# Altium schematic sheet MS20_schematic.SchDoc
size A
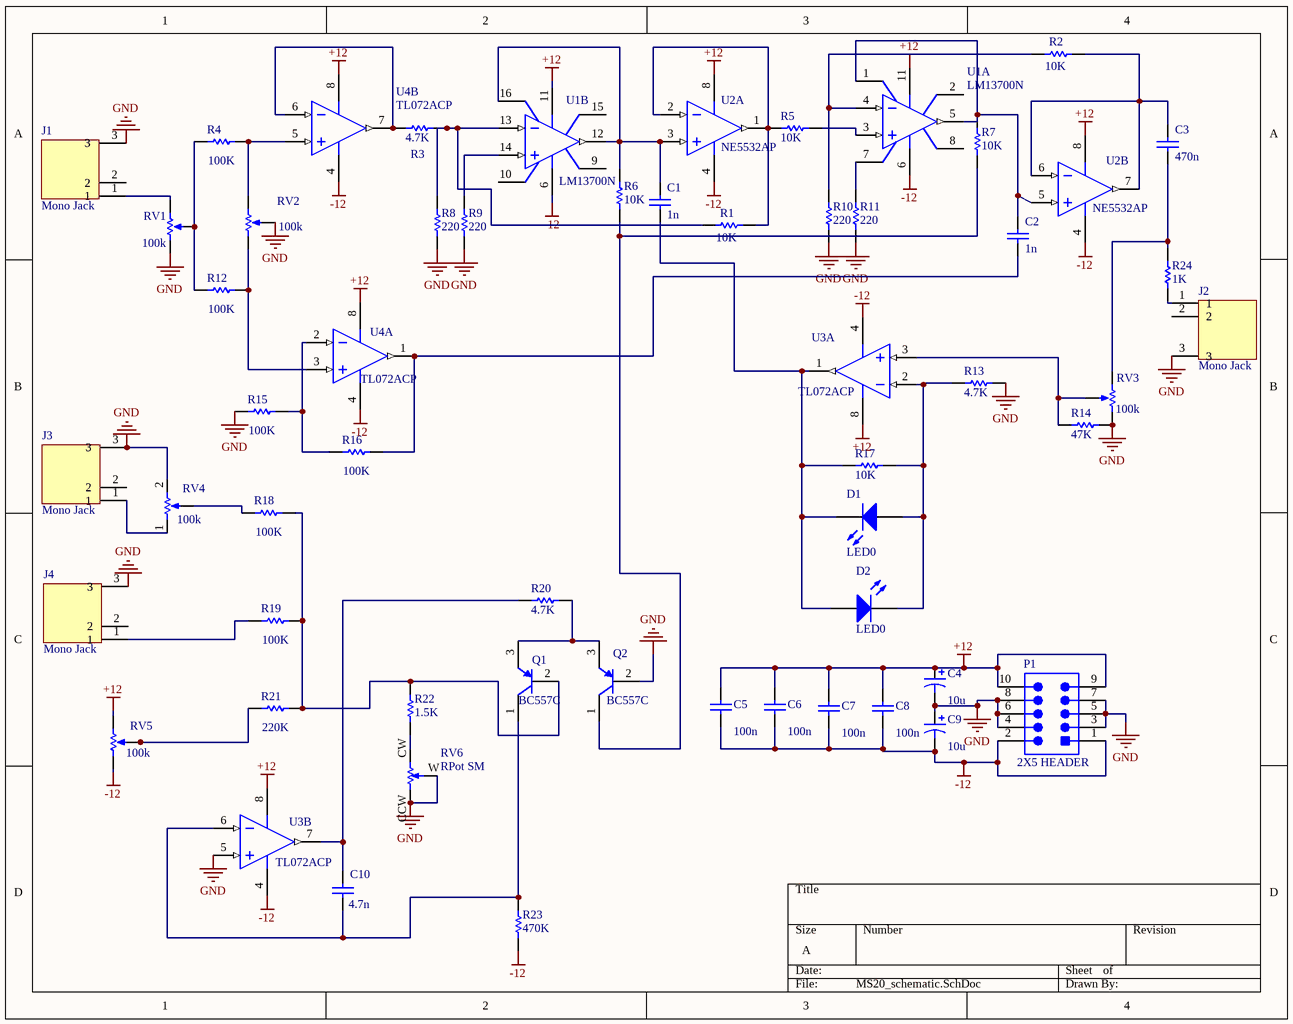
[diagram p0: MS20_schematic.SchDoc]

## Parts
C1  value 1n  [RAD-0.3]  (hidden comment: Cap)
C2  value 1n  [RAD-0.3]  (hidden comment: Cap)
C3  value 470n  [RAD-0.3]  (hidden comment: Cap)
C4  value 10u  [RB7.6-15]  (hidden comment: Cap Pol1)
C5  value 100n  [RAD-0.3]  (hidden comment: Cap)
C6  value 100n  [RAD-0.3]  (hidden comment: Cap)
C7  value 100n  [RAD-0.3]  (hidden comment: Cap)
C8  value 100n  [RAD-0.3]  (hidden comment: Cap)
C9  value 10u  [RB7.6-15]  (hidden comment: Cap Pol1)
C10  value 4.7n  [RAD-0.3]  (hidden comment: Cap)
D1  LED0  [LED-0]
D2  LED0  [LED-0]
J1  Mono Jack  [MONO_Jack]
J2  Mono Jack  [MONO_Jack]
J3  Mono Jack  [MONO_Jack]
J4  Mono Jack  [MONO_Jack]
P1  2X5 HEADER  [TECO-1-1634688-0-10_V]
Q1  BC557C  [ONSC-TO-92-3-29-11]
Q2  BC557C  [ONSC-TO-92-3-29-11]
R1  value 10K  [AXIAL-0.3]  (hidden comment: Res1)
R2  value 10K  [AXIAL-0.3]  (hidden comment: Res1)
R3  value 4.7K  [AXIAL-0.3]  (hidden comment: Res1)
R4  value 100K  [AXIAL-0.3]  (hidden comment: Res1)
R5  value 10K  [AXIAL-0.3]  (hidden comment: Res1)
R6  value 10K  [AXIAL-0.3]  (hidden comment: Res1)
R7  value 10K  [AXIAL-0.3]  (hidden comment: Res1)
R8  value 220  [AXIAL-0.3]  (hidden comment: Res1)
R9  value 220  [AXIAL-0.3]  (hidden comment: Res1)
R10  value 220  [AXIAL-0.3]  (hidden comment: Res1)
R11  value 220  [AXIAL-0.3]  (hidden comment: Res1)
R12  value 100K  [AXIAL-0.3]  (hidden comment: Res1)
R13  value 4.7K  [AXIAL-0.3]  (hidden comment: Res1)
R14  value 47K  [AXIAL-0.3]  (hidden comment: Res1)
R15  value 100K  [AXIAL-0.3]  (hidden comment: Res1)
R16  value 100K  [AXIAL-0.3]  (hidden comment: Res1)
R17  value 10K  [AXIAL-0.3]  (hidden comment: Res1)
R18  value 100K  [AXIAL-0.3]  (hidden comment: Res1)
R19  value 100K  [AXIAL-0.3]  (hidden comment: Res1)
R20  value 4.7K  [AXIAL-0.3]  (hidden comment: Res1)
R21  value 220K  [AXIAL-0.3]  (hidden comment: Res1)
R22  value 1.5K  [AXIAL-0.3]  (hidden comment: Res1)
R23  value 470K  [AXIAL-0.3]  (hidden comment: Res1)
R24  value 1K  [AXIAL-0.3]  (hidden comment: Res1)
RV1  value 100k  [VR5]  (hidden comment: RPot)
RV2  value 100k  [VR5]  (hidden comment: RPot)
RV3  value 100k  [VR5]  (hidden comment: RPot)
RV4  value 100k  [VR5]  (hidden comment: RPot)
RV5  value 100k  [VR5]  (hidden comment: RPot)
RV6  RPot SM  [POT4MM-2]
U1  LM13700N  [NFG0016A]  (parts A,B of 2)
U2  NE5532AP  [P0008A]  (parts A,B of 2)
U3  TL072ACP  [P0008A]  (parts A,B of 2)
U4  TL072ACP  [P0008A]  (parts A,B of 2)

## Nets
+12: C4.1 C5.1 C6.1 C7.1 C8.1 P1.9 P1.10 RV5.2(BOT) U1.11(V+) U2.8(VCC+) U3.8(VCC+) U4.8(VCC+)
-12: C5.2 C6.2 C7.2 C8.2 C9.2 P1.1 P1.2 R23.2 RV5.1(TOP) U1.6(V-) U2.4(VCC-) U3.4(VCC-) U4.4(VCC-)
GND: C4.2 C9.1 J1.3 J2.3 J3.3 J4.3 P1.3 P1.4 P1.5 P1.6 P1.7 P1.8 Q2.2(B) R8.1 R9.1 R10.1 R11.1 R13.1 R14.1 R15.1 RV1.1(TOP) RV2.3(TAP) RV3.2(BOT) RV4.2(BOT) RV6.CCW(-) RV6.W U3.5(IN2+)
NetC1_1: C1.1 R6.2 U1.12(OUT2) U1.16(AMP_BIAS_IN2) U2.3(IN1+)
NetC1_2: C1.2 D1.2(K) D2.1(A) R17.2 U3.1(OUT1)
NetC2_1: C2.1 R7.2 U1.1(AMP_BIAS_IN1) U1.5(OUT1) U2.5(IN2+)
NetC2_2: C2.2 R16.2 U4.1(OUT1)
NetC3_1: C3.1 R2.1 U2.6(IN2-) U2.7(OUT2)
NetC3_2: C3.2 R24.2 RV3.1(TOP)
NetC10_1: C10.1 R20.2 U3.7(OUT2)
NetC10_2: C10.2 Q1.1(C) R23.1 U3.6(IN2-)
NetD1_1: D1.1(A) D2.2(K) R13.2 R17.1 U3.2(IN1-)
NetJ1_1: J1.1 RV1.2(BOT)
NetJ2_1: J2.1 R24.1
NetJ3_1: J3.1 RV4.1(TOP)
NetJ4_1: J4.1 R19.1
NetQ1_2: Q1.2(B) R18.2 R19.2 R21.2 R22.2
NetQ1_3: Q1.3(E) Q2.3(E) R20.1
NetQ2_1: Q2.1(C) R6.1 R7.1
NetR1_1: R1.1 R5.2 U2.1(OUT1) U2.2(IN1-)
NetR1_2: R1.2 R3.1 R8.2 U1.13(IN2-)
NetR2_2: R2.2 R10.2 U1.4(IN1-)
NetR3_2: R3.2 U4.6(IN2-) U4.7(OUT2)
NetR4_1: R4.1 R12.1 RV1.3(TAP)
NetR4_2: R4.2 RV2.2(BOT) U4.5(IN2+)
NetR5_1: R5.1 U1.3(IN1+)
NetR9_2: R9.2 U1.14(IN2+)
NetR11_2: R11.2 U1.7(BUF_IN1)
NetR12_2: R12.2 RV2.1(TOP) U4.3(IN1+)
NetR14_2: R14.2 RV3.3(TAP) U3.3(IN1+)
NetR15_2: R15.2 R16.1 U4.2(IN1-)
NetR18_1: R18.1 RV4.3(TAP)
NetR21_1: R21.1 RV5.3(TAP)
NetR22_1: R22.1 RV6.CW(+)

Not connected (* = marked no-connect by the designer): J1 2; J2 2; J3 2; J4 2; U1 2(DIODE_BIAS1) 8(BUF_OUT1) 9(BUF_OUT2) 10(BUF_IN2) 15(DIODE_BIAS2)

## Library data of the parts
C1-C3 C5-C8 C10 = Cap: Capacitor; Published: 8-Jun-2000; LatestRevisionDate: 17-Jul-2002; LatestRevisionNote: Re-released for DXP Platform.; PackageReference: RAD-0.3; Publisher: Altium Limited; PackageDescription: Radial Cap, Thru-Hole; 2 Leads; 0.3 in Pin Spacing
C4 C9 = Cap Pol1: Polarized Capacitor (Radial); Published: 8-Jun-2000; LatestRevisionDate: 17-Jul-2002; LatestRevisionNote: Re-released for DXP Platform.; PackageReference: RB7.6-15; Publisher: Altium Limited; PackageDescription: Polarized Capacitor (Radial); 2 Leads
D1 D2 = LED0: Typical INFRARED GaAs LED; Published: 8-Jun-2000; LatestRevisionDate: 08-Jul-2005; LatestRevisionNote: Mech Layer 1 removed.; PackageReference: LED-0; Publisher: Altium Limited; PackageDescription: LED; 2 Leads
J1-J4 = 4832.2211: Phone Connectors Audio Socket 3.5MM 2P SCR; Manufacturer: Schurter; Body Material: Metal; Shielding: Shielded; Number of Ports: 1; Max Voltage Rating (AC): 30V; Number of Contacts: 2; Gender: Female; Current Rating: 500mA; Supplier 1: Digi-Key; Manufacturer Part Number: 4832.2211; RoHS: Yes; Category: Audio / Video Connectors; Stock 1: 363; Pricing 1: 1=1.50000, 50=1.38500, 100=1.13400, 500=0.94200, 1000=0.93840 (USD); Mount: Through Hole,Panel; Case/Package: Metal; Weight: 0.077603oz; Contact Plating: Silver; Number of Terminals: 3; Material: Plastic; Min Operating Temperature: -20°C; Max Operating Temperature: 70°C; Packaging: Bulk; Termination: Solder; Orientation: Straight; Package Quantity: 500; Max Current Rating: 500mA; Diameter: 3.5mm; Length: 10.5mm; Depth: 9mm; REACH SVHC: No SVHC; ComponentLink1URL: https://datasheet.ciiva.com/25289/1580985-25289573.pdf?src-supplier=Newark; ComponentLink1Description: https://datasheet.ciiva.com/25289/1580985-25289573.pdf?src-supplier=Newark; ComponentLink2URL: https://datasheet.ciiva.com/12540/typ-4832-2211-58787-12540719.pdf?src-supplier=Mouser; ComponentLink2Description: https://datasheet.ciiva.com/12540/typ-4832-2211-58787-12540719.pdf?src-supplier=Mouser; ComponentLink3URL: https://datasheet.ciiva.com/1086/1580985-1086284.pdf?src-supplier=Element14; ComponentLink3Description: https://datasheet.ciiva.com/1086/1580985-1086284.pdf?src-supplier=Element14; Supplier Part Number 1: 486-3418-ND
P1 = CMP-2000-05854-1: Male Header, Pitch 2.54 mm, 2 x 5 Postion, Height 9.15 mm, Tail Length 3.2 mm, -40 to 105 degC, RoHS, Bulk; Manufacturer: TE Connectivity; PartNumber: 1-1634688-0; No. of Rows: 2; SVHC: ToBeAdvised; Package Version: Rev. C2, 02/2011; No. of Contacts: 10Contacts; Pitch: 2.54mm; No. of Positions: 10; Contact Termination Type: ThroughHole; Package Description: 10-Pin Connector, Body 20.35 x 8.7 mm, Pitch 2.54 mm; Orientation: Straight; Gender: Header; Mounting Technology: ThroughHole; Product Range: -; Datasheet Version: Rev. C2, 02/2011; Contact Material: Brass; Package URL: https://datasheet.ciiva.com/6831/eng-cd-1634688-c2-6831201.pdf; Package Reference: 1-1634688-0; Pitch Spacing: 2.54mm; Contact Plating: GoldPlatedContacts; Manufacturer URL: http://www.te.com/; Datasheet URL: https://datasheet.ciiva.com/6831/eng-cd-1634688-c2-6831201.pdf
Q1 Q2 = CMP-1048-01449-1: Amplifier Transistor, PNP Silicon, 3-Pin TO-92, Bulk Box; Manufacturer: On Semiconductor; IC Continuous (A): -0.1; Polarity: PNP; PartNumber: BC557C; PackageVersion: Rev. AM; RoHS: FALSE; PackageDescription: 3-Pin Transistor Outline, Body 4.825 x 3.685 mm, Pitch 1.27 mm; Packing: Bulk Box; ComponentLink2Description: Datasheet; DatasheetVersion: Rev. 3; ComponentLink3Description: Package Specification; Mounting Technology: Through Hole; ComponentLink2URL: http://www.onsemi.com/pub_link/Collateral/BC556B-D.PDF; ComponentLink1URL: http://www.onsemi.com/; ComponentLink1Description: Manufacturer URL; ComponentLink3URL: http://www.onsemi.cn/pub_link/Collateral/2N6426-D.PDF; PackageReference: TO-92-3-29-11_AM_SL
R1-R24 = Res1: Resistor; Published: 8-Jun-2000; LatestRevisionDate: 17-Jul-2002; LatestRevisionNote: Re-released for DXP Platform.; PackageReference: AXIAL-0.3; Publisher: Altium Limited; PackageDescription: Axial Device, Thru-Hole; 2 Leads; 0.3 in Pin Spacing
RV1-RV5 = RPot: Potentiometer; Sim Note: Enter the Resistance value and the set point into parameter fields.; Set Position: 0.5; Published: 8-Jun-2000; LatestRevisionDate: 17-Jul-2002; LatestRevisionNote: Re-released for DXP Platform.; PackageReference: VR5; Publisher: Altium Limited; PackageDescription: Variable Resistor, Thru-Hole; 3 Leads
RV6 = RPot SM: Square Trimming Potentiometer; Published: 17-Dec-2003; DatasheetVersion: Oct-2003; PackageReference: POT4MM-2; Publisher: Altium Limited; PackageDescription: Square Trimming Potentiometer; ComponentLink1Description: Manufacturer Link; ComponentLink1URL: http://bourns.com/2/search.html
U1 = CMP-0055-00179-3: Dual Operational Transconductance Amplifier with Linearizing Diodes and Buffers, 16-pin MDIP; Manufacturer: Texas Instruments; CompType: Amplifiers; PackageTopMarking: NSUZXYYTTE#*LM13700N; PowerWise: N; PinCount: 16; ComponentLink1URL: http://www.ti.com/general/docs/lit/getliterature.tsp?genericPartNumber=LM13700&fileType=pdf; PackageDescription: MDIP, .750 x .250 x .130in, 16 Lead, .100in Pitch; Package Reference: NFG0016A; Code_JEDEC: MS-001-BB; ComponentLink1Description: Datasheet URL; RoHS: N
U2 = CMP-0017-00921-2: Dual Low-Noise Operational Amplifier, 10 to 30 V, 0 to 70 degC, 8-pin DIP (P8), Pb-Free (RoHS); Manufacturer: Texas Instruments; Vn at 1kHz(Typ)(nV/rtHz): 5; Vio (25C)(Max)(mV): 4; CMRR(Min)(dB): 70; Total Supply Voltage(Min)(+5V is 5, +/-5V is 10): 10; Total Supply Voltage(Max)(+5V is 5, +/-5V is 10): 30; Slew Rate(Typ)(V/us): 9; IIB(Max)(pA): 800000; Number of Channels: 2; Sub Family: General Purpose Amplifier, High Supply Voltage Amplifier (>=30V), Low Noise Amp (<=10nV/rtHz); Eco-Plan: Pb-Free (RoHS); ComponentLink2Description: Datasheet; ComponentLink3URL: http://www.ti.com/litv/pdf/mpdi001b; ComponentLink1URL: http://www.ti.com/; Mounting Technology: Through Hole; ComponentLink1Description: Manufacturer URL; PackageReference: P0008A; DatasheetVersion: SLOS075I; Iq per channel(Max)(mA): 4; ComponentLink2URL: http://www.ti.com/lit/ds/symlink/ne5532a.pdf; PackageDescription: 8-Pin Plastic In-Line, Body 9.59 x 6.35 mm, Pitch 2.54 mm; GBW(Typ)(MHz): 10; ComponentLink3Description: Package Specification; PackageVersion: 4040082/E, 04/2010; Code_JEDEC: MS-001; PartNumber: NE5532AP
U3 U4 = CMP-0017-00929-2: Low-Noise JFET-Input Operational Amplifier, 7 to 36 V, 0 to 70 degC, 8-pin DIP (P8), Pb-Free (RoHS); Manufacturer: Texas Instruments; Iq per channel(Max)(mA): 2.5; Offset Drift(Typ)(uV/C): 18; CMRR(Min)(dB): 75; IIB(Max)(pA): 200; Total Supply Voltage(Max)(+5V is 5, +/-5V is 10): 36; GBW(Typ)(MHz): 3; Slew Rate(Typ)(V/us): 13; Vio (25C)(Max)(mV): 6; Rating: Catalog; Total Supply Voltage(Min)(+5V is 5, +/-5V is 10): 7; Sub Family: General Purpose Amplifier, High Supply Voltage Amplifier (>=30V); Number of Channels: 2; ComponentLink3URL: http://www.ti.com/litv/pdf/mpdi001b; Vn at 1kHz(Typ)(nV/rtHz): 18; ComponentLink1Description: Manufacturer URL; PackageVersion: 4040082/E, 04/2010; ComponentLink2URL: http://www.ti.com/lit/ds/symlink/tl072a.pdf; PackageReference: P0008A; PackageDescription: 8-Pin Plastic In-Line, Body 9.59 x 6.35 mm, Pitch 2.54 mm; DatasheetVersion: SLOS080J; Code_JEDEC: MS-001; ComponentLink3Description: Package Specification; ComponentLink2Description: Datasheet; PartNumber: TL072ACP; ComponentLink1URL: http://www.ti.com/; Mounting Technology: Through Hole; Eco-Plan: Pb-Free (RoHS)